# EasyEDA schematic WifiBackup.json
TITLE: Sheet_1; REV: 1.0; Date: 2026-09-03; Sheet: 1/1; Company: Your Company
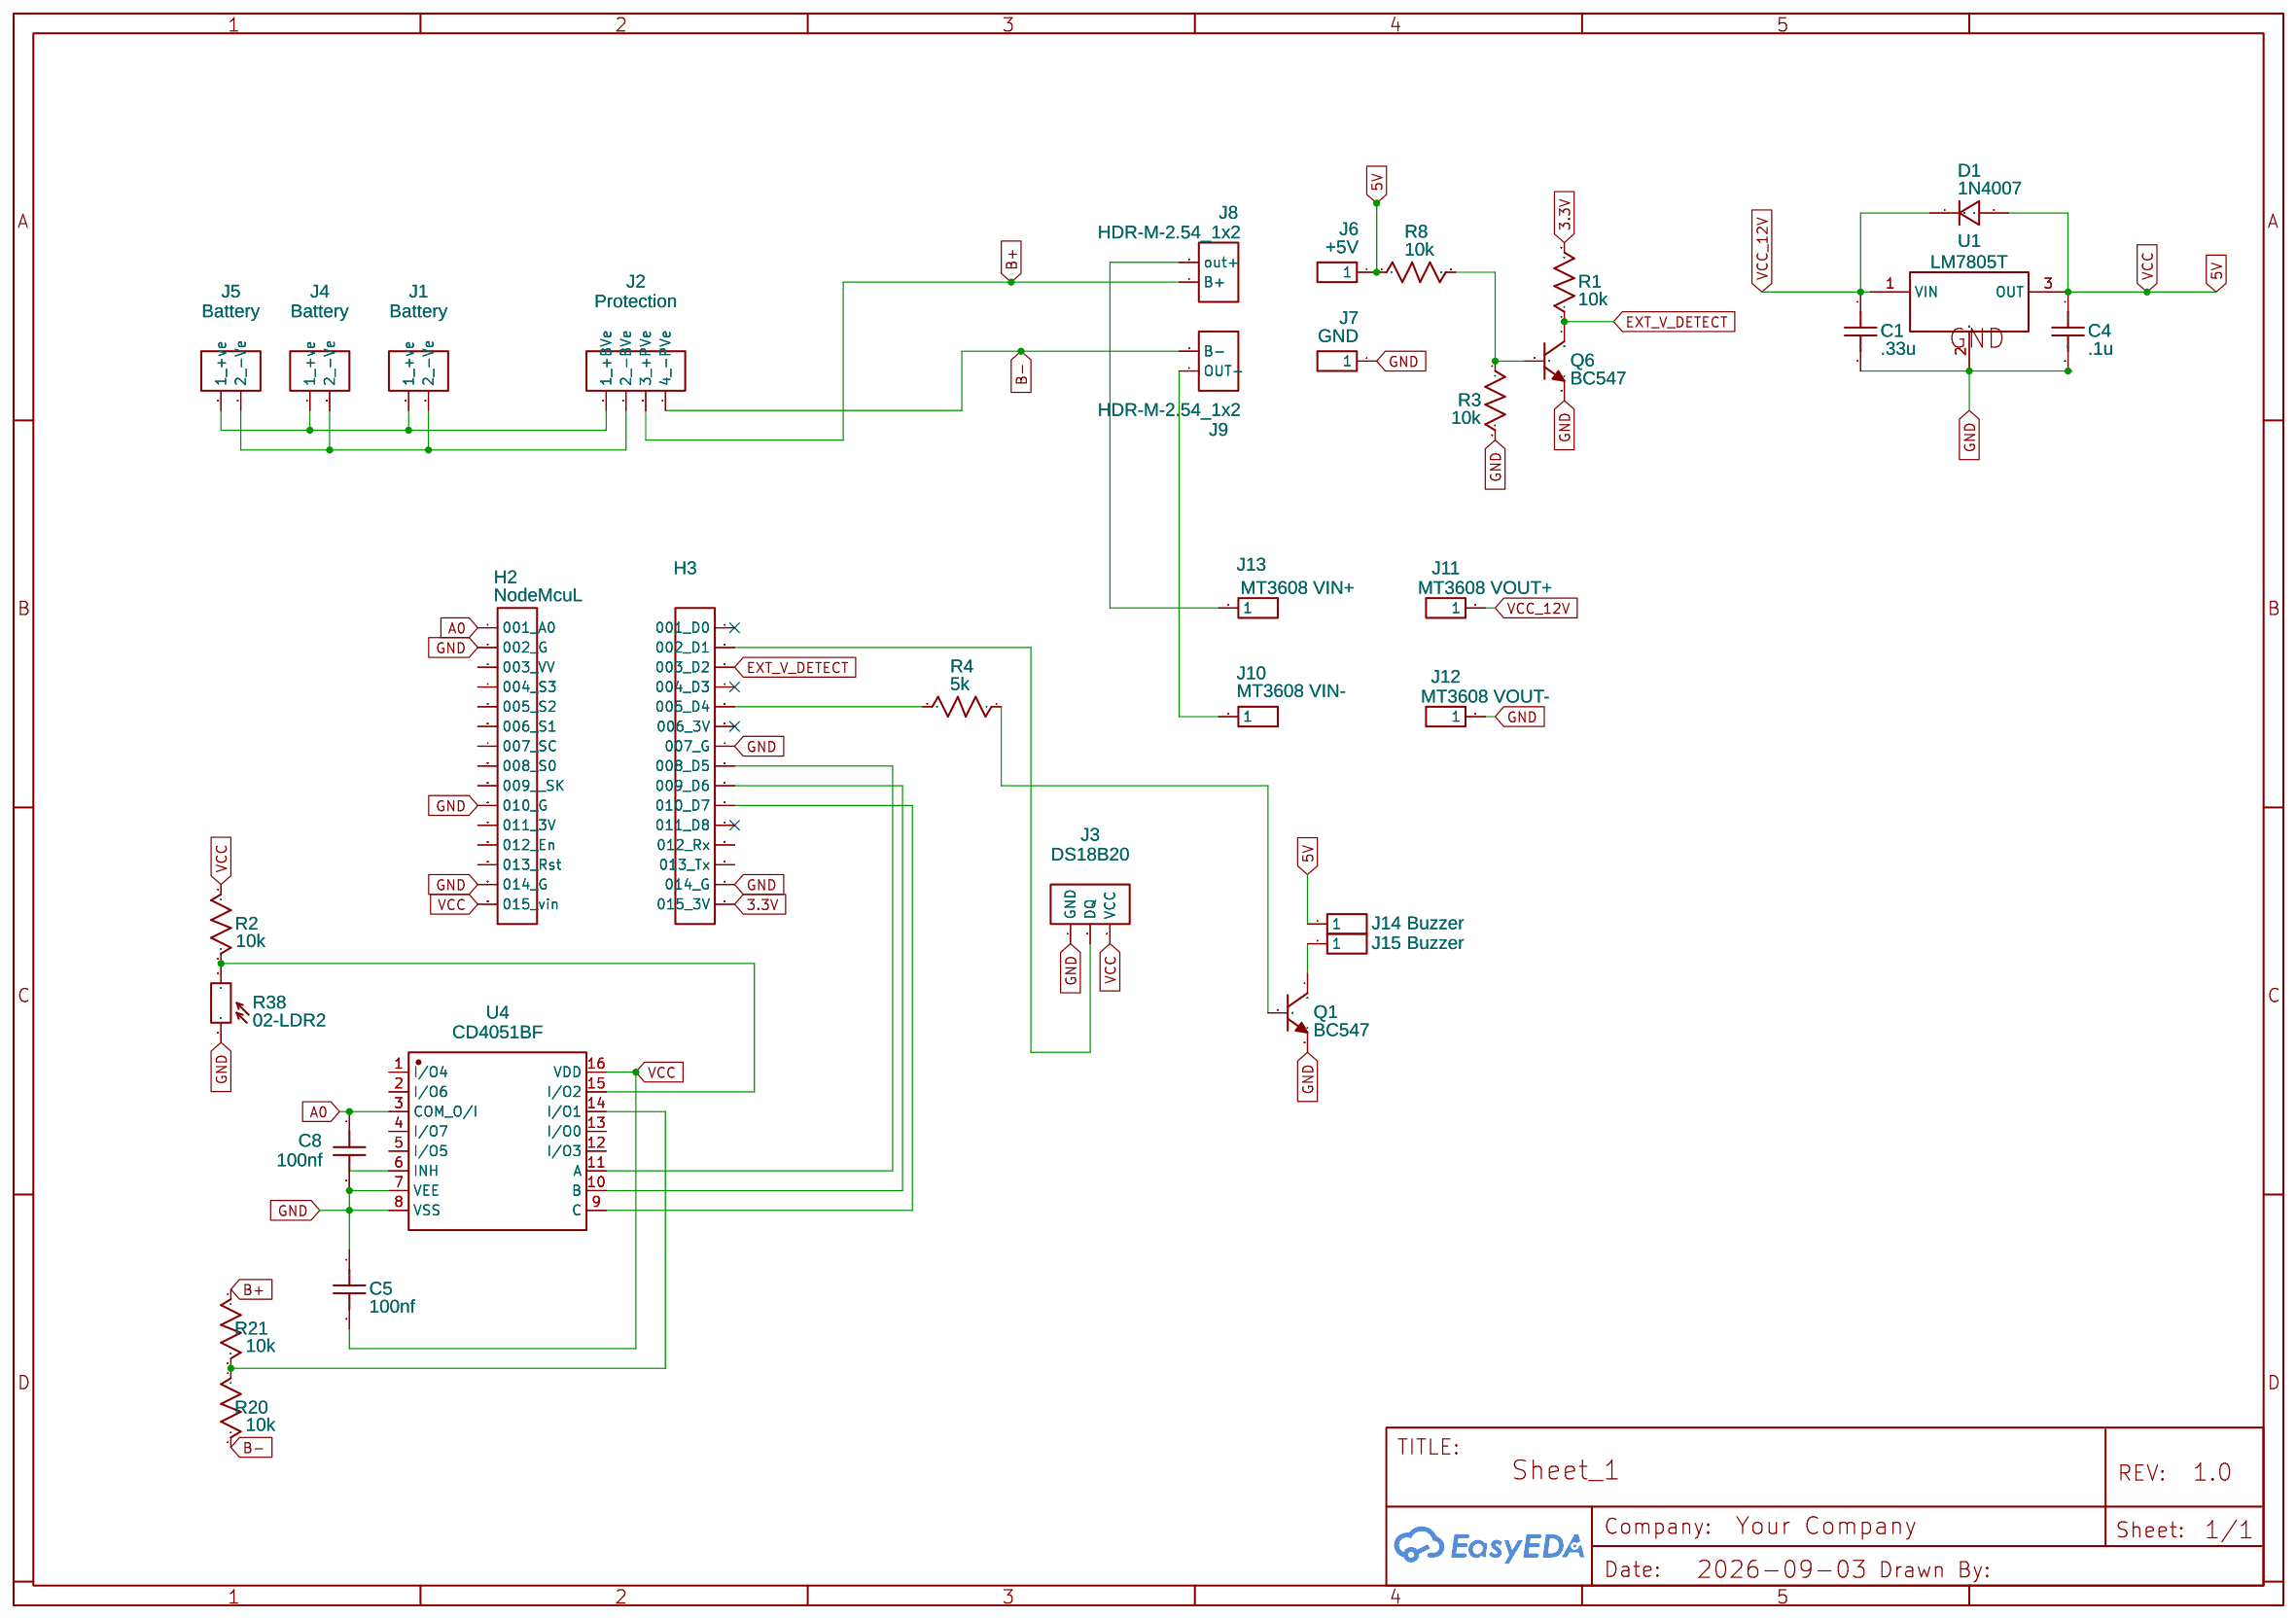
[diagram p0: schematic sheet]

## Parts
C1  .33u  [RAD-0.1]
C4  .1u  [RAD-0.1]
C5  100nf  [RAD-0.1]
C8  100nf  [RAD-0.1]
D1  1N4007  [DO-41_BD2.4-L4.7-P8.70-D0.9-RD]
H2  NodeMcuL  [HDR-F-2.54_1X15]
H3  NodeMcuR  [HDR-F-2.54_1X15]
J1  Battery  [HDR-M-2.54_1X2]
J2  Protection  [HDR-M-2.54_1X4]
J3  DS18B20  [HDR-M-2.54_1X3]
J4  Battery  [HDR-M-2.54_1X2]
J5  Battery  [HDR-M-2.54_1X2]
J6  +5V  [HDR-M-2.54_1X1]
J7  GND  [HDR-M-2.54_1X1]
J8  HDR-M-2.54_1x2  [HDR-M-2.54_1X2]
J9  HDR-M-2.54_1x2  [HDR-M-2.54_1X2]
J10  MT3608 VIN-  [HDR-M-2.54_1X1]
J11  MT3608 VOUT+  [HDR-M-2.54_1X1]
J12  MT3608 VOUT-  [HDR-M-2.54_1X1]
J13  MT3608 VIN+  [HDR-M-2.54_1X1]
J14  Buzzer  [HDR-M-2.54_1X1]
J15  Buzzer  [HDR-M-2.54_1X1]
Q1  BC547  [TO-92-3_L4.5-W3.5-P1.27-L]
Q6  BC547  [TO-92-3_L4.5-W3.5-P1.27-L]
R1  10k  [R_AXIAL-0.3]
R2  10k  [R_AXIAL-0.3]
R3  10k  [R_AXIAL-0.3]
R4  5k  [R_AXIAL-0.3]
R8  10k  [R_AXIAL-0.3]
R20  10k  [R_AXIAL-0.3]
R21  10k  [R_AXIAL-0.3]
R38  02-LDR2  [RES-TH_L5.0-W4.3-P3.40-D0.5]
U1  LM7805T  [TO-220-3_L10.0-W4.5-P2.54-L]
U4  CD4051BF  [PDIP-16_L19.3-W6.4-P2.54-LS7.94-BL]

## Library data of the parts
C1 C4 C5 C8 = C_RAD-0.1_US: Contributor: LCEDA_Lib
D1 = 1N4007: Supplier: LCSC; Manufacturer: SEMTECH; Supplier Part: C106903; Contributor: LCEDA_Lib
H2 H3 = HDR-F-2.54_1x15: Supplier Part: C124408; Supplier: LCSC; Contributor: LCEDA_Lib
J1 J4 J5 J8 J9 = HDR-M-2.54_1x2: Supplier Part: C124375; Supplier: LCSC; Contributor: LCEDA_Lib
J2 = HDR-M-2.54_1x4: Supplier Part: C124378; Supplier: LCSC; Contributor: LCEDA_Lib
J3 = HDR-M-2.54_1x3: Supplier Part: C180248; Supplier: LCSC; Contributor: LCEDA_Lib
J6 J7 J10-J15 = HDR-M-2.54_1x1: Supplier Part: C81276; Supplier: LCSC; Contributor: LCEDA_Lib
Q1 Q6 = BC547: Contributor: LCSC; Supplier: LCSC; Supplier Part: C2910381; Manufacturer: CJ(江苏长电/长晶); Manufacturer Part: BC547(RANGE:420-800); JLCPCB Part Class: Extended Part
R1-R4 R8 R20 R21 = R_AXIAL-0.3_US: Contributor: LCEDA_Lib
R38 = 02-LDR2: Supplier: LCSC; Supplier Part: C17271554; Manufacturer: NTE Electronics; JLCPCB Part Class: Extended Part; Contributor: lcsc
U1 = LM7805T: Contributor: LCSC; Supplier: LCSC; Supplier Part: C507145; Manufacturer: HGC(华冠); JLCPCB Part Class: Extended Part
U4 = CD4051BF: Contributor: lcsc; Supplier: LCSC; Supplier Part: C3657417; Manufacturer: TI(德州仪器); JLCPCB Part Class: Extended Part

## Nets
3.3V: H3.15(015 3V) R1.2
5V: C4.1 C5.2 D1.2 H2.15(015 vin) J3.3(VCC) J6.1 J14.1 R2.1 R8.1 U1.3(OUT) U4.16(VDD)
GND: C1.2 C4.2 C5.1 C8.2 H2.2(002 G) H2.10(010 G) H2.14(014 G) H3.7(007 G) H3.14(014 G) J3.1(GND) J7.1 J12.1 Q1.3(E) Q6.3(E) R3.2 R38.2 U1.2(GND) U4.6(INH) U4.7(VEE) U4.8(VSS)
VCC_12V: C1.1 D1.1 J11.1 U1.1(VIN)
A0: C8.1 H2.1(001 A0) U4.3(COM_O/I)
B+: J2.3(3 +PVe) J8.1(B+) R21.1
B-: J2.4(4 -PVe) J9.2(B-) R20.2
EXT_V_DETECT: H3.3(003 D2) Q6.1(C) R1.1
Net-(H3-2): H3.2(002 D1) J3.2(DQ)
Net-(H3-5): H3.5(005 D4) R4.2
Net-(H3-8): H3.8(008 D5) U4.11(A)
Net-(H3-9): H3.9(009 D6) U4.10(B)
Net-(H3-10): H3.10(010 D7) U4.9(C)
Net-(J1-1): J1.1(1 +ve) J2.1(1 +BVe) J4.1(1 +ve) J5.1(1 +ve)
Net-(J1-2): J1.2(2 -Ve) J2.2(2 -BVe) J4.2(2 -Ve) J5.2(2 -Ve)
Net-(J8-2): J8.2(out+) J13.1
Net-(J9-1): J9.1(OUT-) J10.1
Net-(J15-1): J15.1 Q1.1(C)
Net-(Q1-2): Q1.2(B) R4.1
Net-(Q6-2): Q6.2(B) R3.1 R8.2
Net-(R2-2): R2.2 R38.1 U4.15(I/O2)
Net-(R20-1): R20.1 R21.2 U4.14(I/O1)

Not connected (* = marked no-connect by the designer): H2 3(003 VV) 4(004 S3) 5(005 S2) 6(006 S1) 7(007 SC) 8(008 S0) 9(009  SK) 11(011 3V) 12(012 En) 13(013 Rst); H3 1(001 D0)* 4(004 D3)* 6(006 3V)* 11(011 D8)* 12(012 Rx) 13(013 Tx); U4 1(I/O4) 2(I/O6) 4(I/O7) 5(I/O5) 12(I/O3) 13(I/O0)
